# Altium schematic sheet Isolation.SchDoc
size A4; SheetNumber: 7; SheetTotal: 7
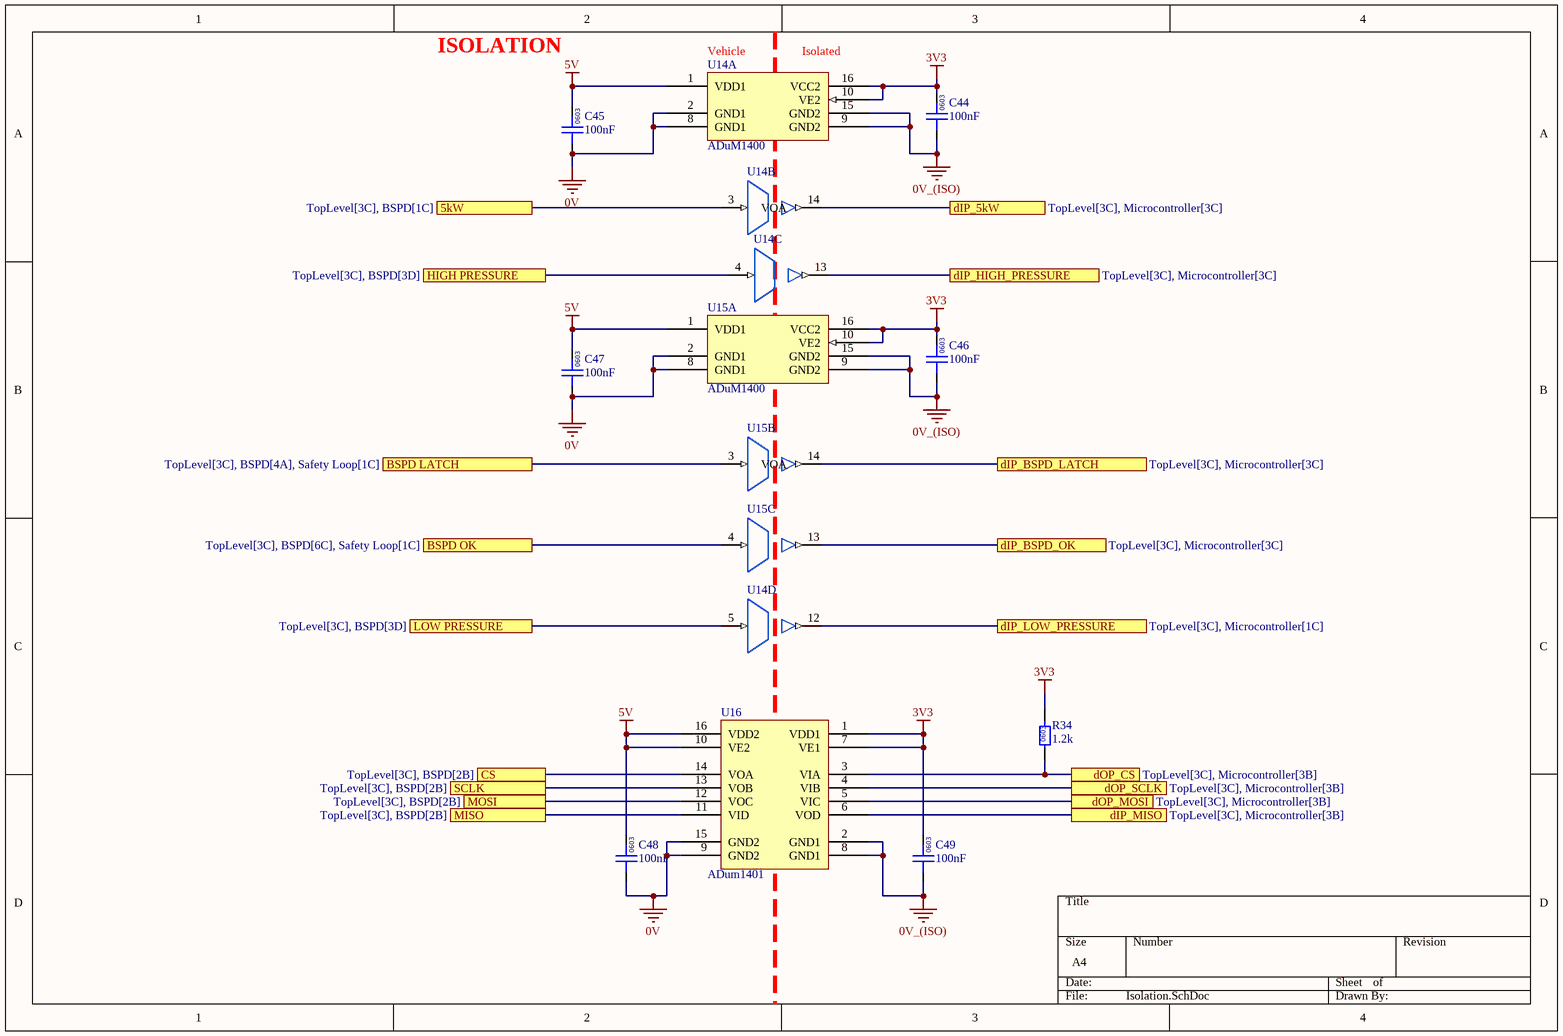
[diagram p0: Isolation.SchDoc]

## Parts
C44  100nF  [0603]
C45  100nF  [0603]
C46  100nF  [0603]
C47  100nF  [0603]
C48  100nF  [0603]
C49  100nF  [0603]
R34  1.2k  [0603]
U14  ADuM1400  [AD 16-SOIC]  (parts A,B,C,D of 5)
U15  ADuM1400  [AD 16-SOIC]  (parts A,B,C of 5)
U16  ADum1401  [AD 16-SOIC]

## Ports
5kW (see TopLevel[3C], BSPD[1C]), BSPD LATCH (see TopLevel[3C], BSPD[4A], Safety Loop[1C]), BSPD OK (see TopLevel[3C], BSPD[6C], Safety Loop[1C]), CS (see TopLevel[3C], BSPD[2B]), dIP_5kW (see TopLevel[3C], Microcontroller[3C]), dIP_BSPD_LATCH (see TopLevel[3C], Microcontroller[3C]), dIP_BSPD_OK (see TopLevel[3C], Microcontroller[3C]), dIP_HIGH_PRESSURE (see TopLevel[3C], Microcontroller[3C]), dIP_LOW_PRESSURE (see TopLevel[3C], Microcontroller[1C]), dIP_MISO (see TopLevel[3C], Microcontroller[3B]), dOP_CS (see TopLevel[3C], Microcontroller[3B]), dOP_MOSI (see TopLevel[3C], Microcontroller[3B]), dOP_SCLK (see TopLevel[3C], Microcontroller[3B]), HIGH PRESSURE (see TopLevel[3C], BSPD[3D]), LOW PRESSURE (see TopLevel[3C], BSPD[3D]), MISO (see TopLevel[3C], BSPD[2B]), MOSI (see TopLevel[3C], BSPD[2B]), SCLK (see TopLevel[3C], BSPD[2B])

## Nets
0V: C45.1 C47.1 C48.1 U14.2(GND1) U14.8(GND1) U15.2(GND1) U15.8(GND1) U16.9(GND2) U16.15(GND2)
0V_(ISO): C44.1 C46.1 C49.1 U14.9(GND2) U14.15(GND2) U15.9(GND2) U15.15(GND2) U16.2(GND1) U16.8(GND1)
3V3: C44.2 C46.2 C49.2 R34.2 U14.10(VE2) U14.16(VCC2) U15.10(VE2) U15.16(VCC2) U16.1(VDD1) U16.7(VE1)
5V: C45.2 C47.2 C48.2 U14.1(VDD1) U15.1(VDD1) U16.10(VE2) U16.16(VDD2)
5kW: U14.3(VIA) ; port 5kW
BSPD LATCH: U15.3(VIA) ; port BSPD LATCH
BSPD OK: U15.4(VIB) ; port BSPD OK
CS: U16.14(VOA) ; port CS
dIP_5kW: U14.14(VOA) ; port dIP_5kW
dIP_BSPD_LATCH: U15.14(VOA) ; port dIP_BSPD_LATCH
dIP_BSPD_OK: U15.13(VOB) ; port dIP_BSPD_OK
dIP_HIGH_PRESSURE: U14.13(VOB) ; port dIP_HIGH_PRESSURE
dIP_LOW_PRESSURE: U14.12(VOC) ; port dIP_LOW_PRESSURE
dIP_MISO: U16.6(VOD) ; port dIP_MISO
dOP_CS: R34.1 U16.3(VIA) ; port dOP_CS
dOP_MOSI: U16.5(VIC) ; port dOP_MOSI
dOP_SCLK: U16.4(VIB) ; port dOP_SCLK
HIGH PRESSURE: U14.4(VIB) ; port HIGH PRESSURE
LOW PRESSURE: U14.5(VIC) ; port LOW PRESSURE
MISO: U16.11(VID) ; port MISO
MOSI: U16.12(VOC) ; port MOSI
SCLK: U16.13(VOB) ; port SCLK

## Notes on the sheet
- ISOLATION
- (near U14) Vehicle
- (near U14) Isolated
- (in symbol GCM188L81H104KA57D) 0603
- (in symbol RC0603JR-071K2L) 0603

## Library data of the parts
C44-C49 = GCM188L81H104KA57D: Manufacturer: muRata; Rated Voltage: 50V; Tolerance: ±10%; Material: MLCC; Temperature Rating: X8L; Part Number: GCM188L81H104KA57D; Value: 100nF; Digikey Part Number: 490-6049-1-ND
R34 = RC0603JR-071K2L: Manufacturer: YAGEO; Tolerance: 0.01; Rated Power: 0.1W; Part Number: RC0603JR-071K2L; Value: 1.2k; Material: FR-07; Digikey Part Number: 311-1.2KGRCT-ND
U14 U15 = ADuM1400: General Purpose Digital Isolator 2500Vrms 4 Channel 1Mbps 25kV/µs CMTI 16-SOIC (0.295", 7.50mm Width); Manufacturer: Analog Devices; Part Number: ADuM1400; Digikey Part Number: ADUM1400WSRWZ-ND; Digikey Link: https://www.digikey.com/product-detail/en/analog-devices-inc/ADUM1400WSRWZ/ADUM1400WSRWZ-ND/1873713
U16 = ADuM1401: General Purpose Digital Isolator 2500Vrms 4 Channel 1Mbps 25kV/µs CMTI 16-SOIC (0.295", 7.50mm Width); Manufacturer: Analog Devices; Part Number: ADuM1401